# EAGLE design altimeter (EAGLE 8.6.0)
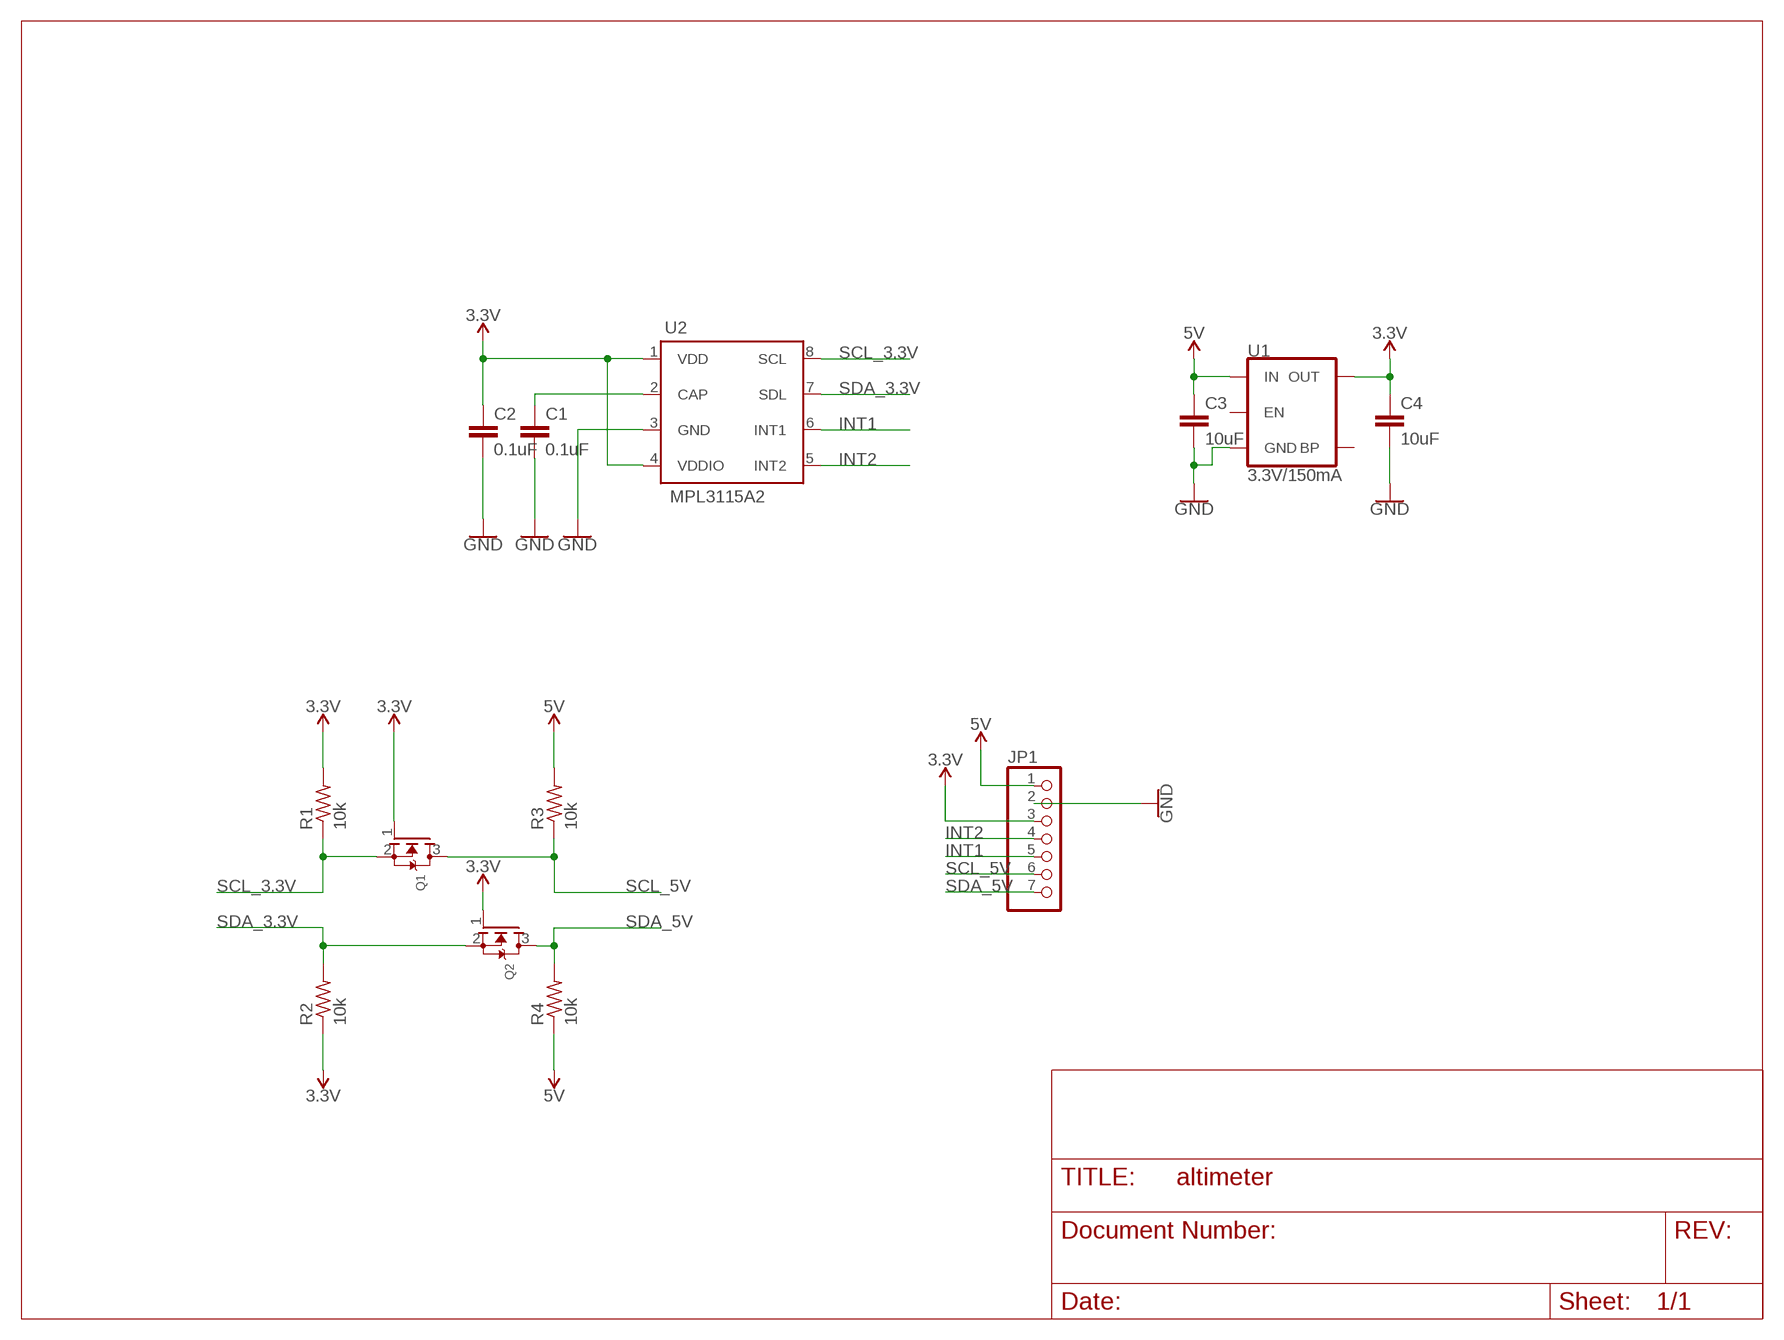
[diagram p0: schematic, sheet 1]

## Parts
C1  0.1uF  C-EUC0805  [C0805]
C2  0.1uF  C-EUC0805  [C0805]
C3  10uF  C-EUC0805  [C0805]
C4  10uF  C-EUC0805  [C0805]
JP1  PINHD-1X7  [1X07]
Q1  MOSFET-NWAVE  [SOT23-W]
Q2  MOSFET-NWAVE  [SOT23-W]
R1  10k  R-US_R0805  [R0805]
R2  10k  R-US_R0805  [R0805]
R3  10k  R-US_R0805  [R0805]
R4  10k  R-US_R0805  [R0805]
U1  3.3V/150mA  V_REG_MIC52053.3V  [SOT23-5]
U2  MPL3115A2  [LGA8]

## Nets
3.3V: C2.1 C4.1 JP1.3 Q1.1(G) Q2.1(G) R1.2 R2.1 U1.5(OUT) U2.1(VDD) U2.4(VDDIO)
5V: C3.1 JP1.1 R3.2 R4.1 U1.1(IN)
GND: C1.2 C2.2 C3.2 C4.2 JP1.2 U1.2(GND) U2.3(GND)
INT1: JP1.5 U2.6(INT1)
INT2: JP1.4 U2.5(INT2)
N$2: C1.1 U2.2(CAP)
SCL_3.3V: Q1.2(S) R1.1 U2.8(SCL)
SCL_5V: JP1.6 Q1.3(D) R3.1
SDA_3.3V: Q2.2(S) R2.2 U2.7(SDL)
SDA_5V: JP1.7 Q2.3(D) R4.2
Unconnected: U1.3(EN) U1.4(BP)

## Library data of the parts
C1-C4 = rcl:C-EU: CAPACITOR, European symbol; SPICEPREFIX: C
JP1 = pinhead:PINHD-1X7: PIN HEADER
Q1 Q2 = adafruit:MOSFET-N: N-Channel Mosfet 2N7002E - 60V 260mA SOT23 [Digikey: 2N7002ET1GOSTR-ND] - REEL BSH103 - 30V 850mA SOT23 [Digikey: 568-5013-1-ND]
R1-R4 = adafruit:R-US_: RESISTOR, American symbol
U1 = SparkFun-IC-Power:V_REG_MIC5205: V_REG MIC5205 Standard 3.3V, 5V, and Adjustable 150mA LDO voltage regulator in SOT-23 layout. Micrel part MIC5205. BP (by-pass) pin is used to lower output noise with 470pF cap, may be left open. On the adjustable version BP is used to set output.; PROD_ID: VREG-00822
U2 = hygiea_parts:MPL3115A2

## Board
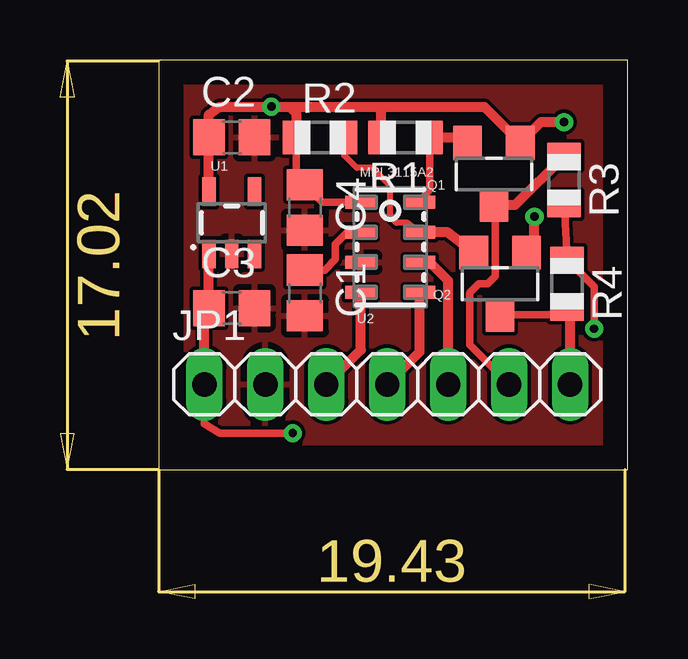
[diagram p1: board, top side]
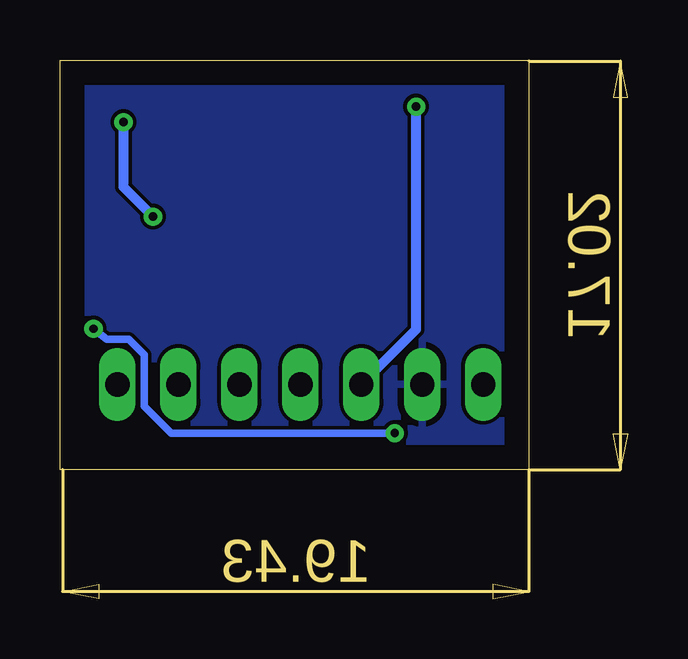
[diagram p2: board, bottom side, seen from below]

Size 19.54 x 17.07 mm. Coordinates in mm from the lower left corner, seen from the top.
Outline: 0,0 19.54,0 19.54,17.07 0,17.07 0,0
Copper layers (1*16): Top 0.035mm / dielectric 1.5mm / Bottom 0.035mm
Design rules "default": minimum track width 6mil, minimum drill 0.35mm, track to track 6mil, track to pad 6mil, pad to pad 6mil, via to via 6mil, smd to smd 6mil, copper to edge 40mil, drill to drill 6mil, minimum pad ring 10mil, minimum via ring 8mil, stop-mask expansion 4mil, vias tented up to drill 0mil, thermal gap 10mil

### Footprints (pad centres in the part's own frame; a part is rotated, then mirrored left to right if it is on the bottom)
C0805 = smd 1.3 x 1.5: 1 -0.95,0; 2 0.95,0
1X07 = drill 1.016 long: 1 -7.62,0; 2 -5.08,0; 3 -2.54,0; 4 0,0; 5 2.54,0; 6 5.08,0; 7 7.62,0
SOT23-W = smd 1.2 x 1.4: 1 -1.1,-1.3; 2 1.1,-1.3; 3 0,1.3
R0805 = smd 1.1 x 1.4: 1 -1,0; 2 1,0
SOT23-5 = smd 0.55 x 1.2: 1 -0.95,-1.3; 2 0,-1.3; 3 0.95,-1.3; 4 0.95,1.3; 5 -0.95,1.3
LGA8 = smd 1.291 x 0.55: 1 -1.227,1.875; 2 -1.227,0.625; 3 -1.227,-0.625; 4 -1.227,-1.875; 5 1.227,-1.875; 6 1.227,-0.625; 7 1.227,0.625; 8 1.227,1.875

### Placement (x,y rotation side)
C1  6.1,7.37 270 top
C2  3.05,13.84 0 top
C3  3.05,6.73 0 top
C4  6.1,10.92 270 top
JP1  9.53,3.56 0 top
Q1  13.97,12.32 180 top
Q2  14.22,7.75 180 top
R1  10.29,13.84 180 top
R2  6.73,13.84 0 top
R3  16.89,12.06 270 top
R4  17.02,7.75 270 top
U1  3.05,10.29 0 top
U2  9.65,9.27 0 top

### Tracks (layer width: path | path; a pad name or v marks a point on that pad's centre or on a via)
3.3V  (via drill 0.35)
  Top 0.305: 5.73,12.24 R2.1 | U2.1 6.82,11.15 C4.1 | v4.7,15.12 v4.71,15.11 5.08,15.11
  Top 0.406: U1.5 C2.1 2.1,14.8 2.54,15.11 5.08,15.11 5.46,15.11 | R2.1 5.73,14.84 5.46,15.11 | C4.1 5.73,12.24 | 5.46,15.11 9.27,15.11 | 9.27,15.11 13.58,15.11 Q1.1 15.93,14.48 v16.89,14.48 | R1.2 9.27,13.86 9.27,15.11 | Q2.1 15.66,9.64 v15.66,10.54 | JP1.3 8.43,5 U2.4
  Bottom 0.406: v15.66,10.54 16.89,11.77 v16.89,14.48 | JP1.3 4.7,5.84 v4.7,15.12
5V  (via drill 0.35)
  Top 0.305: R3.2 R4.1 18.14,7.62 v18.14,5.87 | JP1.1 1.91,1.91 2.54,1.52 4.96,1.52 v5.59,1.52
  Top 0.406: JP1.1 1.91,6.54 C3.1 U1.1
  Bottom 0.305: v18.14,5.87 17.58,5.44 16.68,5.44 16.03,4.78 16.03,2.64 14.91,1.52 v5.59,1.52
GND
  Top 0.406: C3.2 4.31,6.42
  pour Top: 0,0 19.68,0 19.68,17.02 0,17.02
  pour Bottom: 0,0 19.56,0 19.56,17.02 0,17.02
INT1
  Top 0.406: JP1.5 12.06,7.87 11.29,8.65 U2.6
INT2
  Top 0.406: JP1.4 10.88,4.91 U2.5
N$2
  Top 0.305: C1.1 6.92,8.32 7.37,8.76 7.37,9.4 7.86,9.9 U2.2
SCL_3.3V
  Top 0.305: U2.8 11.29,11.68 R1.1
  Top 0.406: R1.1 12.65,13.84 Q1.2
SCL_5V
  Top 0.305: JP1.6 12.95,5.21 12.95,7.37 13.34,7.75 13.72,7.75 14.03,8.06 14.03,10.96 Q1.3
  Top 0.406: R3.1 14.85,11.02 Q1.3
SDA_3.3V
  Top 0.254: U2.7 10.36,10.29 9.91,10.29 9.65,10.54 9.65,11.81 8.89,12.57 8.26,12.57 7.73,13.1 R2.2
  Top 0.406: Q2.2 12.02,9.9 U2.7
SDA_5V
  Top 0.305: Q2.3 16.59,6.45
  Top 0.406: 16.59,6.45 R4.2 17.14,6.62 JP1.7